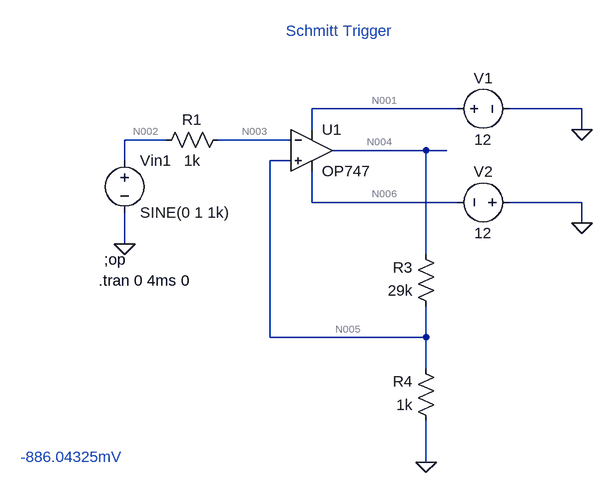
[diagram p0: schematic Schmitt_trigger.asc]
Schmitt_trigger.asc, the LTspice schematic file:
Version 4
SHEET 1 880 680
WIRE 448 16 224 16
WIRE 640 16 528 16
WIRE 224 48 224 16
WIRE 640 48 640 16
WIRE 0 64 -64 64
WIRE 192 64 80 64
WIRE 400 80 256 80
WIRE 432 80 400 80
WIRE -64 96 -64 64
WIRE 192 96 160 96
WIRE 224 160 224 112
WIRE 448 160 224 160
WIRE 640 160 528 160
WIRE 640 192 640 160
WIRE -64 224 -64 176
WIRE 400 240 400 80
WIRE 160 368 160 96
WIRE 400 368 400 320
WIRE 400 368 160 368
WIRE 400 416 400 368
WIRE 400 560 400 496
FLAG -64 224 0
FLAG 640 48 0
FLAG 640 192 0
FLAG 400 560 0
SYMBOL voltage 432 16 R270
WINDOW 0 32 56 VTop 2
WINDOW 3 -32 56 VBottom 2
WINDOW 123 0 0 Left 0
WINDOW 39 0 0 Left 0
SYMATTR InstName V1
SYMATTR Value 12
SYMBOL voltage 544 160 R90
WINDOW 0 -32 56 VBottom 2
WINDOW 3 32 56 VTop 2
WINDOW 123 0 0 Left 0
WINDOW 39 0 0 Left 0
SYMATTR InstName V2
SYMATTR Value 12
SYMBOL res 96 48 R90
WINDOW 0 0 56 VBottom 2
WINDOW 3 32 56 VTop 2
SYMATTR InstName R1
SYMATTR Value 1k
SYMBOL OpAmps\\OP747 224 16 R0
SYMATTR InstName U1
SYMBOL voltage -64 80 R0
WINDOW 123 0 0 Left 0
WINDOW 39 0 0 Left 0
SYMATTR InstName Vin1
SYMATTR Value SINE(0 1 1k)
SYMBOL res 416 336 R180
WINDOW 0 36 76 Left 2
WINDOW 3 36 40 Left 2
SYMATTR InstName R3
SYMATTR Value 29k
SYMBOL res 416 512 R180
WINDOW 0 36 76 Left 2
WINDOW 3 36 40 Left 2
SYMATTR InstName R4
SYMATTR Value 1k
TEXT -96 248 Left 2 !;op
TEXT -104 280 Left 2 !.tran 0 4ms 0
TEXT 184 -104 Left 2 ;Schmitt Trigger
TEXT -224 552 Left 2 ;-886.04325mV

The netlist it stands for:
* Schmitt_trigger.asc
V1 N001 0 12
V2 0 N006 12
R1 N003 N002 1k
XU1 N005 N003 N001 N006 N004 OP747  ; pins In+ In- V+ V- OUT
Vin1 N002 0 SINE(0 1 1k)
R3 N005 N004 29k
R4 0 N005 1k
;op
.tran 0 4ms 0
* Schmitt Trigger
* -886.04325mV
.backanno
.end

* Results of the author's LTspice run, read from the files saved beside the schematic
* Operating Point, zero values left out:
*   V(n001) = 12 V
*   V(n006) = -12 V
*   V(n003) = 9.068 µV
*   V(n005) = -70.93 µV
*   V(n004) = -2.449 mV
*   I(R1) = 9.068 nA
*   I(R3) = 82 nA
*   I(R4) = 70.93 nA
*   I(V1) = -282.8 µA
*   I(V2) = -282.8 µA
*   I(Vin1) = 9.068 nA
*   Ix(u1:1) = -11.07 nA
*   Ix(u1:2) = -9.068 nA
*   Ix(u1:99) = 282.8 µA
*   Ix(u1:50) = -282.8 µA
*   Ix(u1:45) = 82 nA
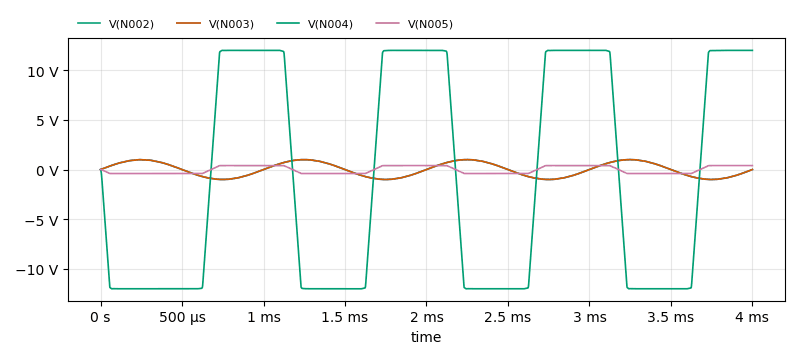
[diagram p1: Transient Analysis of Schmitt_trigger.asc, plotted from the saved traces]
* Transient Analysis, 1 run:
*   V(N002): min -999.8 mV, max 1 V, average -379.7 µV, rms 705.7 mV, last 0 V
*   V(N003): min -999.7 mV, max 999.8 mV, average -374.8 µV, rms 705.7 mV, last 19.18 µV
*   V(N004): min -12 V, max 11.99 V, average -978 mV, rms 11.2 V, last 11.99 V
*   V(N005): min -399.9 mV, max 399.8 mV, average -32.59 mV, rms 373.4 mV, last 399.7 mV